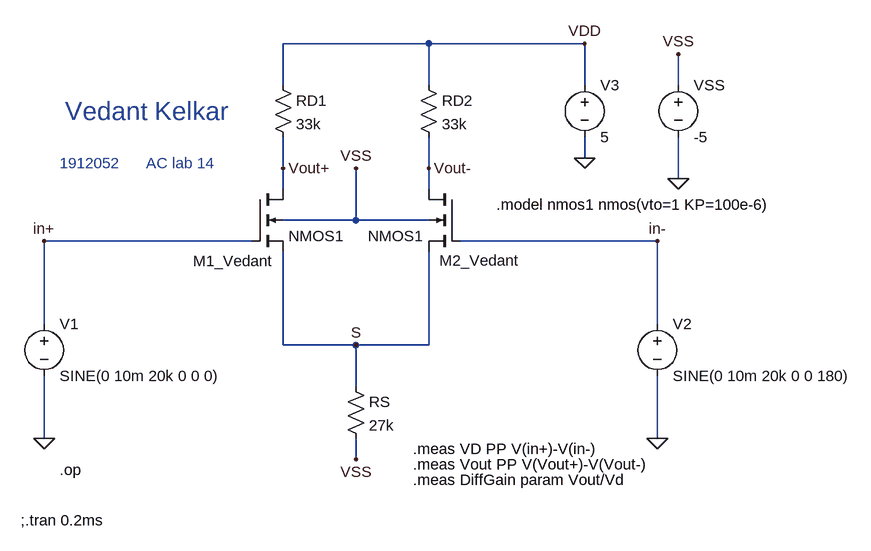
[diagram p0: schematic Draft47.asc]
Draft47.asc, the LTspice schematic file:
Version 4
SHEET 1 880 680
WIRE 64 -224 -160 -224
WIRE 304 -224 64 -224
WIRE -160 -160 -160 -224
WIRE 64 -160 64 -224
WIRE 304 -160 304 -224
WIRE 448 -160 448 -208
WIRE 304 -48 304 -80
WIRE -160 -32 -160 -80
WIRE 64 -32 64 -80
WIRE 448 -16 448 -80
WIRE -160 0 -160 -32
WIRE 64 0 64 -32
WIRE -48 48 -48 -32
WIRE -48 48 -160 48
WIRE 64 48 -48 48
WIRE -208 80 -528 80
WIRE 416 80 112 80
WIRE -528 208 -528 80
WIRE 416 208 416 80
WIRE -160 240 -160 96
WIRE -48 240 -160 240
WIRE 64 240 64 96
WIRE 64 240 -48 240
WIRE -48 304 -48 240
WIRE -528 384 -528 288
WIRE 416 384 416 288
WIRE -48 416 -48 384
FLAG -528 384 0
FLAG -160 -32 Vout+
FLAG 416 384 0
FLAG 64 -32 Vout-
FLAG -48 240 S
FLAG 304 -48 0
FLAG 304 -224 VDD
FLAG -48 416 VSS
FLAG -48 -32 VSS
FLAG 448 -16 0
FLAG 448 -208 VSS
FLAG 416 80 in-
FLAG -528 80 in+
SYMBOL voltage -528 192 R0
WINDOW 123 0 0 Left 0
WINDOW 39 0 0 Left 0
SYMATTR InstName V1
SYMATTR Value SINE(0 10m 20k 0 0 0)
SYMBOL res -176 -176 R0
SYMATTR InstName RD1
SYMATTR Value 33k
SYMBOL voltage 416 192 R0
WINDOW 123 0 0 Left 0
WINDOW 39 0 0 Left 0
SYMATTR InstName V2
SYMATTR Value SINE(0 10m 20k 0 0 180)
SYMBOL res 48 -176 R0
SYMATTR InstName RD2
SYMATTR Value 33k
SYMBOL res -64 288 R0
SYMATTR InstName RS
SYMATTR Value 27k
SYMBOL voltage 304 -176 R0
WINDOW 123 0 0 Left 0
WINDOW 39 0 0 Left 0
SYMATTR InstName V3
SYMATTR Value 5
SYMBOL nmos4 -208 0 R0
WINDOW 0 -91 111 Left 2
SYMATTR InstName M1_Vedant
SYMATTR Value NMOS1
SYMBOL nmos4 112 0 M0
WINDOW 0 -92 110 Left 2
SYMATTR InstName M2_Vedant
SYMATTR Value NMOS1
SYMBOL voltage 448 -176 R0
SYMATTR InstName VSS
SYMATTR Value -5
TEXT -496 -120 Left 4 ;Vedant Kelkar
TEXT -504 -40 Left 2 ;1912052      AC lab 14
TEXT 168 24 Left 2 !.model nmos1 nmos(vto=1 KP=100e-6)
TEXT -504 432 Left 2 !.op
TEXT -564 510 Left 2 !;.tran 0.2ms
TEXT 40 400 Left 2 !.meas VD PP V(in+)-V(in-)
TEXT 40 424 Left 2 !.meas Vout PP V(Vout+)-V(Vout-)
TEXT 40 448 Left 2 !.meas DiffGain param Vout/Vd

The netlist it stands for:
* Draft47.asc
V1 in+ 0 SINE(0 10m 20k 0 0 0)
RD1 VDD Vout+ 33k
V2 in- 0 SINE(0 10m 20k 0 0 180)
RD2 VDD Vout- 33k
RS S VSS 27k
V3 VDD 0 5
M1_Vedant Vout+ in+ S VSS NMOS1
M2_Vedant Vout- in- S VSS NMOS1
VSS VSS 0 -5
.model NMOS NMOS
.model PMOS PMOS
.lib standard.mos
* Vedant Kelkar
* 1912052      AC lab 14
.model nmos1 nmos(vto=1 KP=100e-6)
.op
;.tran 0.2ms
.meas VD PP V(in+)-V(in-)
.meas Vout PP V(Vout+)-V(Vout-)
.meas DiffGain param Vout/Vd
.backanno
.end